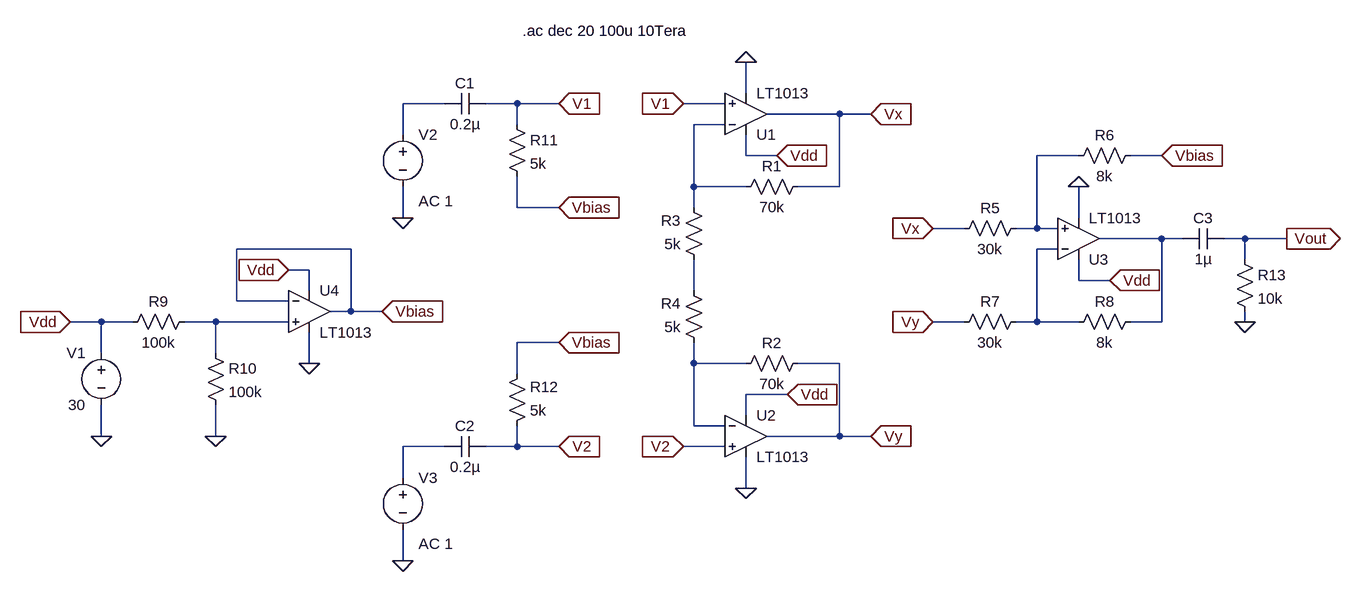
[diagram p0: schematic Q2.2.asc]
Q2.2.asc, the LTspice schematic file:
Version 4
SHEET 1 1332 680
WIRE 400 -64 400 -112
WIRE -64 -48 -128 -48
WIRE 48 -48 0 -48
WIRE 112 -48 48 -48
WIRE 368 -48 304 -48
WIRE 544 -32 432 -32
WIRE 592 -32 544 -32
WIRE 48 -16 48 -48
WIRE 368 -16 320 -16
WIRE -128 0 -128 -48
WIRE 400 32 400 0
WIRE 448 32 400 32
WIRE 912 32 848 32
WIRE 1040 32 992 32
WIRE 320 80 320 -16
WIRE 400 80 320 80
WIRE 544 80 544 -32
WIRE 544 80 480 80
WIRE 48 112 48 64
WIRE 112 112 48 112
WIRE 320 112 320 80
WIRE -128 128 -128 80
WIRE 912 128 912 80
WIRE 736 144 688 144
WIRE 848 144 848 32
WIRE 848 144 816 144
WIRE 880 144 848 144
WIRE 1040 160 944 160
WIRE 1072 160 1040 160
WIRE 1168 160 1136 160
WIRE 1232 160 1168 160
WIRE -208 176 -384 176
WIRE 880 176 848 176
WIRE 1168 192 1168 160
WIRE -272 208 -304 208
WIRE 912 224 912 192
WIRE 960 224 912 224
WIRE -272 240 -272 208
WIRE 320 240 320 192
WIRE -384 256 -384 176
WIRE -304 256 -384 256
WIRE -208 272 -208 176
WIRE -208 272 -240 272
WIRE -160 272 -208 272
WIRE -592 288 -640 288
WIRE -544 288 -592 288
WIRE -416 288 -464 288
WIRE -304 288 -416 288
WIRE 736 288 688 288
WIRE 848 288 848 176
WIRE 848 288 816 288
WIRE 912 288 848 288
WIRE 1040 288 1040 160
WIRE 1040 288 992 288
WIRE 1168 288 1168 272
WIRE 112 320 48 320
WIRE -592 336 -592 288
WIRE -416 336 -416 288
WIRE -272 352 -272 304
WIRE 320 352 320 320
WIRE 400 352 320 352
WIRE 544 352 480 352
WIRE 48 368 48 320
WIRE 464 400 400 400
WIRE 400 432 400 400
WIRE 320 448 320 352
WIRE 368 448 320 448
WIRE -592 464 -592 416
WIRE -416 464 -416 416
WIRE 544 464 544 352
WIRE 544 464 432 464
WIRE 592 464 544 464
WIRE -64 480 -128 480
WIRE 48 480 48 448
WIRE 48 480 0 480
WIRE 112 480 48 480
WIRE 368 480 304 480
WIRE -128 528 -128 480
WIRE 400 544 400 496
WIRE -128 656 -128 608
FLAG 304 -48 V1
IOPIN 304 -48 In
FLAG 304 480 V2
IOPIN 304 480 In
FLAG 400 -112 0
FLAG 400 544 0
FLAG 464 400 Vdd
IOPIN 464 400 In
FLAG 448 32 Vdd
IOPIN 448 32 In
FLAG 592 -32 Vx
IOPIN 592 -32 In
FLAG 592 464 Vy
IOPIN 592 464 In
FLAG 1232 160 Vout
IOPIN 1232 160 Out
FLAG 688 144 Vx
IOPIN 688 144 In
FLAG 688 288 Vy
IOPIN 688 288 In
FLAG 912 80 0
FLAG 960 224 Vdd
IOPIN 960 224 In
FLAG -592 464 0
FLAG -416 464 0
FLAG -272 352 0
FLAG -640 288 Vdd
IOPIN -640 288 In
FLAG -160 272 Vbias
IOPIN -160 272 In
FLAG -304 208 Vdd
IOPIN -304 208 In
FLAG 1040 32 Vbias
IOPIN 1040 32 In
FLAG -128 128 0
FLAG -128 656 0
FLAG 112 -48 V1
IOPIN 112 -48 In
FLAG 112 480 V2
IOPIN 112 480 In
FLAG 112 112 Vbias
IOPIN 112 112 In
FLAG 112 320 Vbias
IOPIN 112 320 In
FLAG 1168 288 0
SYMBOL opamps/LT1013 400 32 M180
SYMATTR InstName U1
SYMBOL opamps/LT1013 400 400 R0
SYMATTR InstName U2
SYMBOL opamps/LT1013 912 224 M180
SYMATTR InstName U3
SYMBOL res 496 64 R90
WINDOW 0 0 56 VBottom 2
WINDOW 3 32 56 VTop 2
SYMATTR InstName R1
SYMATTR Value 70k
SYMBOL res 496 336 R90
WINDOW 0 0 56 VBottom 2
WINDOW 3 32 56 VTop 2
SYMATTR InstName R2
SYMATTR Value 70k
SYMBOL res 336 208 R180
WINDOW 0 36 76 Left 2
WINDOW 3 36 40 Left 2
SYMATTR InstName R3
SYMATTR Value 5k
SYMBOL res 336 336 R180
WINDOW 0 36 76 Left 2
WINDOW 3 36 40 Left 2
SYMATTR InstName R4
SYMATTR Value 5k
SYMBOL res 832 128 R90
WINDOW 0 0 56 VBottom 2
WINDOW 3 32 56 VTop 2
SYMATTR InstName R5
SYMATTR Value 30k
SYMBOL res 1008 16 R90
WINDOW 0 0 56 VBottom 2
WINDOW 3 32 56 VTop 2
SYMATTR InstName R6
SYMATTR Value 8k
SYMBOL res 832 272 R90
WINDOW 0 0 56 VBottom 2
WINDOW 3 32 56 VTop 2
SYMATTR InstName R7
SYMATTR Value 30k
SYMBOL res 1008 272 R90
WINDOW 0 0 56 VBottom 2
WINDOW 3 32 56 VTop 2
SYMATTR InstName R8
SYMATTR Value 8k
SYMBOL voltage -592 320 M0
SYMATTR InstName V1
SYMATTR Value 30
SYMBOL res -560 304 R270
WINDOW 0 32 56 VTop 2
WINDOW 3 0 56 VBottom 2
SYMATTR InstName R9
SYMATTR Value 100k
SYMBOL res -432 320 R0
SYMATTR InstName R10
SYMATTR Value 100k
SYMBOL opamps/LT1013 -272 208 R0
SYMATTR InstName U4
SYMBOL cap 0 -64 R90
WINDOW 0 0 32 VBottom 2
WINDOW 3 32 32 VTop 2
SYMATTR InstName C1
SYMATTR Value 0.2µ
SYMBOL cap 0 464 R90
WINDOW 0 0 32 VBottom 2
WINDOW 3 32 32 VTop 2
SYMATTR InstName C2
SYMATTR Value 0.2µ
SYMBOL res 32 -32 R0
SYMATTR InstName R11
SYMATTR Value 5k
SYMBOL res 32 464 M180
WINDOW 0 36 76 Left 2
WINDOW 3 36 40 Left 2
SYMATTR InstName R12
SYMATTR Value 5k
SYMBOL res 1152 176 R0
SYMATTR InstName R13
SYMATTR Value 10k
SYMBOL cap 1136 144 R90
WINDOW 0 0 32 VBottom 2
WINDOW 3 32 32 VTop 2
SYMATTR InstName C3
SYMATTR Value 1µ
SYMBOL voltage -128 -16 R0
WINDOW 123 24 118 Left 2
SYMATTR Value2 AC 1
SYMATTR InstName V2
SYMATTR Value ""
SYMBOL voltage -128 512 R0
WINDOW 123 24 118 Left 2
SYMATTR Value2 AC 1
SYMATTR InstName V3
SYMATTR Value ""
TEXT 56 -160 Left 2 !.ac dec 20 100u 10Tera

The netlist it stands for:
* Q2.2.asc
XU1 V1 N002 Vdd 0 Vx LT1013  ; pins In+ In- V+ V- OUT
XU2 V2 N008 Vdd 0 Vy LT1013  ; pins In+ In- V+ V- OUT
XU3 N003 N005 Vdd 0 N004 LT1013  ; pins In+ In- V+ V- OUT
R1 Vx N002 70k
R2 Vy N008 70k
R3 N006 N002 5k
R4 N008 N006 5k
R5 N003 Vx 30k
R6 Vbias N003 8k
R7 N005 Vy 30k
R8 N004 N005 8k
V1 Vdd 0 30
R9 Vdd N007 100k
R10 N007 0 100k
XU4 N007 Vbias Vdd 0 Vbias LT1013  ; pins In+ In- V+ V- OUT
C1 V1 N001 0.2µ
C2 V2 N009 0.2µ
R11 V1 Vbias 5k
R12 V2 Vbias 5k
R13 Vout 0 10k
C3 Vout N004 1µ
V2 N001 0 AC 1
V3 N009 0 AC 1
.ac dec 20 100u 10Tera
.lib LTC.lib
.backanno
.end